# EAGLE design Main_oak_cm4_16 (EAGLE 9.6.2)
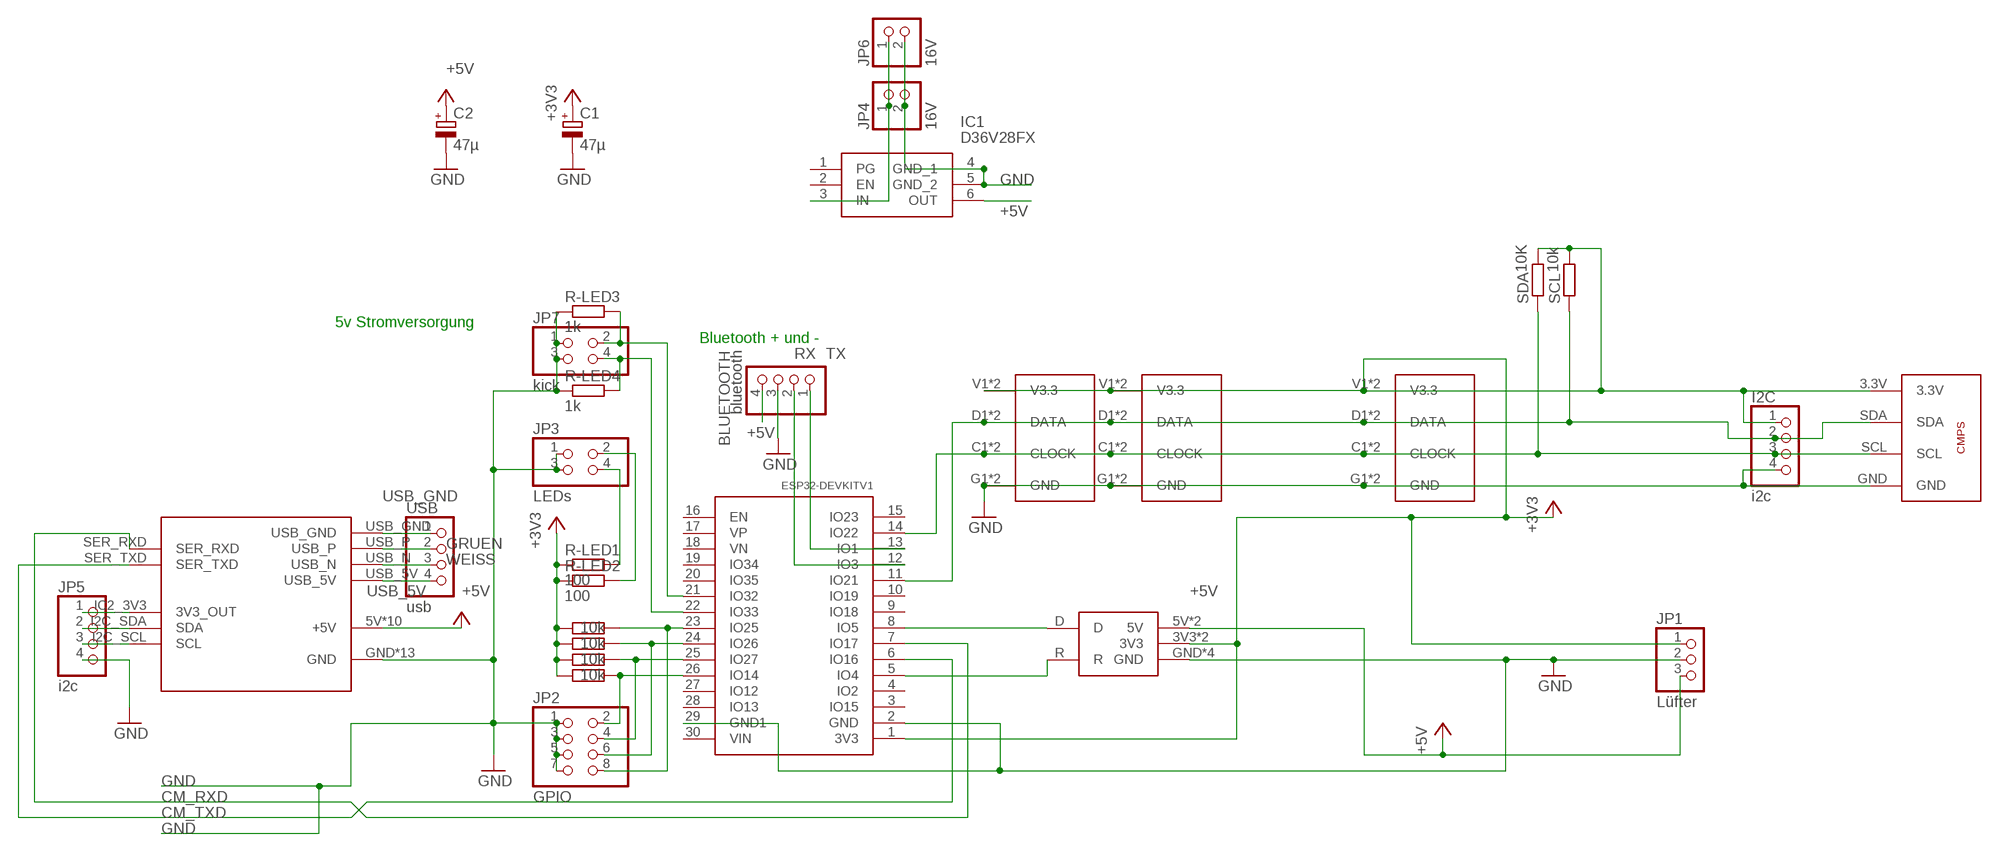
[diagram p0: schematic, sheet 1]

## Parts
BLUETOOTH  bluetooth  PINHD-1X4  [1X04]
C1  47µ  CPOL-EUE2,5-6E  [E2,5-6E]
C2  47µ  CPOL-EUE2,5-6E  [E2,5-6E]
I2C  i2c  PINHD-1X4  [1X04]
IC1  D36V28FX  [D36V28FX]
JP1  Lüfter  PINHD-1X3  [1X03]
JP2  GPIO  PINHD-2X4  [2X04]
JP3  LEDs  PINHD-2X2  [2X02]
JP4  16V  PINHD-1X2  [1X02]
JP5  i2c  PINHD-1X4  [1X04]
JP6  16V  PINHD-1X2  [1X02]
JP7  kick  PINHD-2X2  [2X02]
R-LED1  100  R-EU_0207/10  [0207/10]
R-LED2  100  R-EU_0207/10  [0207/10]
R-LED3  1k  R-EU_0207/10  [0207/10]
R-LED4  1k  R-EU_0207/10  [0207/10]
R_AD14  10k  R-EU_0207/10  [0207/10]
R_AD25  10k  R-EU_0207/10  [0207/10]
R_AD26  10k  R-EU_0207/10  [0207/10]
R_AD27  10k  R-EU_0207/10  [0207/10]
SCL  10k  R-EU_0207/10  [0207/10]
SDA  10K  R-EU_0207/10  [0207/10]
U$1  TASTER_LED  [TASTER_LED]
U$3  TASTER_LED  [TASTER_LED]
U$5  CM4-ADAPTER  [CM4-ADAPTER]
U$7  TASTER_LED  [TASTER_LED]
U$8  CMPS  [CMPS]
U$11  CANBUS  [CANBUS]
U$13  ESP32DEVKITV1  [ESP32-DEVKITV1]
USB  usb  PINHD-1X4  [1X04]

## Nets
+3V3: C1.+ I2C.1 JP1.1 R-LED1.1 R-LED2.1 R_AD14.1 R_AD25.1 R_AD26.1 R_AD27.1 SCL.2 SDA.2 U$1.V1(V3.3) U$1.V2(V3.3) U$3.V1(V3.3) U$3.V2(V3.3) U$7.V1(V3.3) U$7.V2(V3.3) U$8.3.3V U$11.3V3 U$11.3V3_1(3V3) U$13.1(3V3)
+5V: BLUETOOTH.4 C2.+ IC1.6(OUT) JP1.3 U$5.5V(+5V) U$5.5V.1(+5V) U$5.5V.2(+5V) U$5.5V.3(+5V) U$5.5V.4(+5V) U$5.5V.5(+5V) U$5.5V.6(+5V) U$5.5V.7(+5V) U$5.5V.8(+5V) U$5.5V.9(+5V) U$11.5V U$11.5V_1(5V)
CLOCK: I2C.3 SDA.1 U$1.C1(CLOCK) U$1.C2(CLOCK) U$3.C1(CLOCK) U$3.C2(CLOCK) U$7.C1(CLOCK) U$7.C2(CLOCK) U$8.SCL U$13.14(IO22)
CM_RXD: U$5.SER_RXD U$13.7(IO17)
CM_TXD: U$5.SER_TXD U$13.6(IO16)
D: U$11.D U$13.8(IO5)
DATA: I2C.2 SCL.1 U$1.D1(DATA) U$1.D2(DATA) U$3.D1(DATA) U$3.D2(DATA) U$7.D1(DATA) U$7.D2(DATA) U$8.SDA U$13.11(IO21)
GND: BLUETOOTH.3 C1.- C2.- I2C.4 IC1.4(GND_1) IC1.5(GND_2) JP1.2 JP2.1 JP2.3 JP2.5 JP2.7 JP3.1 JP3.3 JP4.2 JP5.4 JP6.2 JP7.1 JP7.3 R-LED3.1 R-LED4.1 U$1.G1(GND) U$1.G2(GND) U$3.G1(GND) U$3.G2(GND) U$5.GND U$5.GND1(GND) U$5.GND2(GND) U$5.GND3(GND) U$5.GND4(GND) U$5.GND5(GND) U$5.GND6(GND) U$5.GND7(GND) U$5.GND8(GND) U$5.GND9(GND) U$5.I2C_GND(GND) U$5.SER_GND2(GND) U$5.SER_GND(GND) U$7.G1(GND) U$7.G2(GND) U$8.GND U$11.GND U$11.GND_1(GND) U$11.GND_2(GND) U$11.GND_3(GND) U$13.2(GND) U$13.29(GND1)
GRUEN: U$5.USB_P USB.2
IO14: JP2.2 R_AD14.2 U$13.26(IO14)
IO25: JP2.8 R_AD25.2 U$13.23(IO25)
IO26: JP2.6 R_AD26.2 U$13.24(IO26)
IO27: JP2.4 R_AD27.2 U$13.25(IO27)
IO32: JP7.2 R-LED3.2 U$13.21(IO32)
IO33: JP7.4 R-LED4.2 U$13.22(IO33)
N$7: IC1.3(IN) JP4.1 JP6.1
N$8: JP3.4 R-LED1.2
N$9: JP3.2 R-LED2.2
N$10: JP5.1 U$5.IC2_3V3(3V3_OUT)
N$11: JP5.2 U$5.I2C_SDA(SDA)
N$12: JP5.3 U$5.I2C_SCL(SCL)
R: U$11.R U$13.5(IO4)
RX: BLUETOOTH.2 U$13.12(IO3)
TX: BLUETOOTH.1 U$13.13(IO1)
USB_5V: U$5.USB_5V USB.4
USB_GND: U$5.USB_GND USB.1
WEISS: U$5.USB_N USB.3
Unconnected: IC1.1(PG) IC1.2(EN) U$13.3(IO15) U$13.4(IO2) U$13.9(IO18) U$13.10(IO19) U$13.15(IO23) U$13.16(EN) U$13.17(VP) U$13.18(VN) U$13.19(IO34) U$13.20(IO35) U$13.27(IO12) U$13.28(IO13) U$13.30(VIN)

## Notes on the sheet
- 5v Stromversorgung
- Bluetooth + und -

## Library data of the parts
BLUETOOTH I2C JP5 USB = pinhead:PINHD-1X4: PIN HEADER
C1 C2 = rcl:CPOL-EU: POLARIZED CAPACITOR, European symbol; SPICEPREFIX: C
IC1 = D36V28FX:D36V28FX: 5V, 3.2A Step-Down Voltage Regulator D36V28F5 Source: Datasheet <https://www.pololu.com/product/3782>; DESCRIPTION: 5V, 3.2A Step-Down Voltage Regulator D36V28F5; HEIGHT: 8.77mm; MANUFACTURER_NAME: POLOLU ROBOTICS & ELECTRONICS; MANUFACTURER_PART_NUMBER: D36V28FX
JP1 = pinhead:PINHD-1X3: PIN HEADER
JP2 = pinhead:PINHD-2X4: PIN HEADER
JP3 JP7 = pinhead:PINHD-2X2: PIN HEADER
JP4 JP6 = pinhead:PINHD-1X2: PIN HEADER
R-LED1-R-LED4 R_AD14 R_AD25-R_AD27 SCL SDA = rcl:R-EU_: RESISTOR, European symbol; SPICEPREFIX: R
U$1 U$3 U$7 = Taster_LED:TASTER_LED: Taster / LED Board mit 2 Tastern und 2 LEDs Angeschlossen über i2c Port Expander PCF8574TS i2c Adresse zwingend per Lötbrücke zu setzen.
U$5 = cm4-adapter:CM4-ADAPTER
U$8 = cmps:CMPS: CMPS cmps11, cmps12, cmps14 Kompass-Sensor
U$11 = canbus:CANBUS
U$13 = ESP32-DEVKITV1:ESP32DEVKITV1

## Board
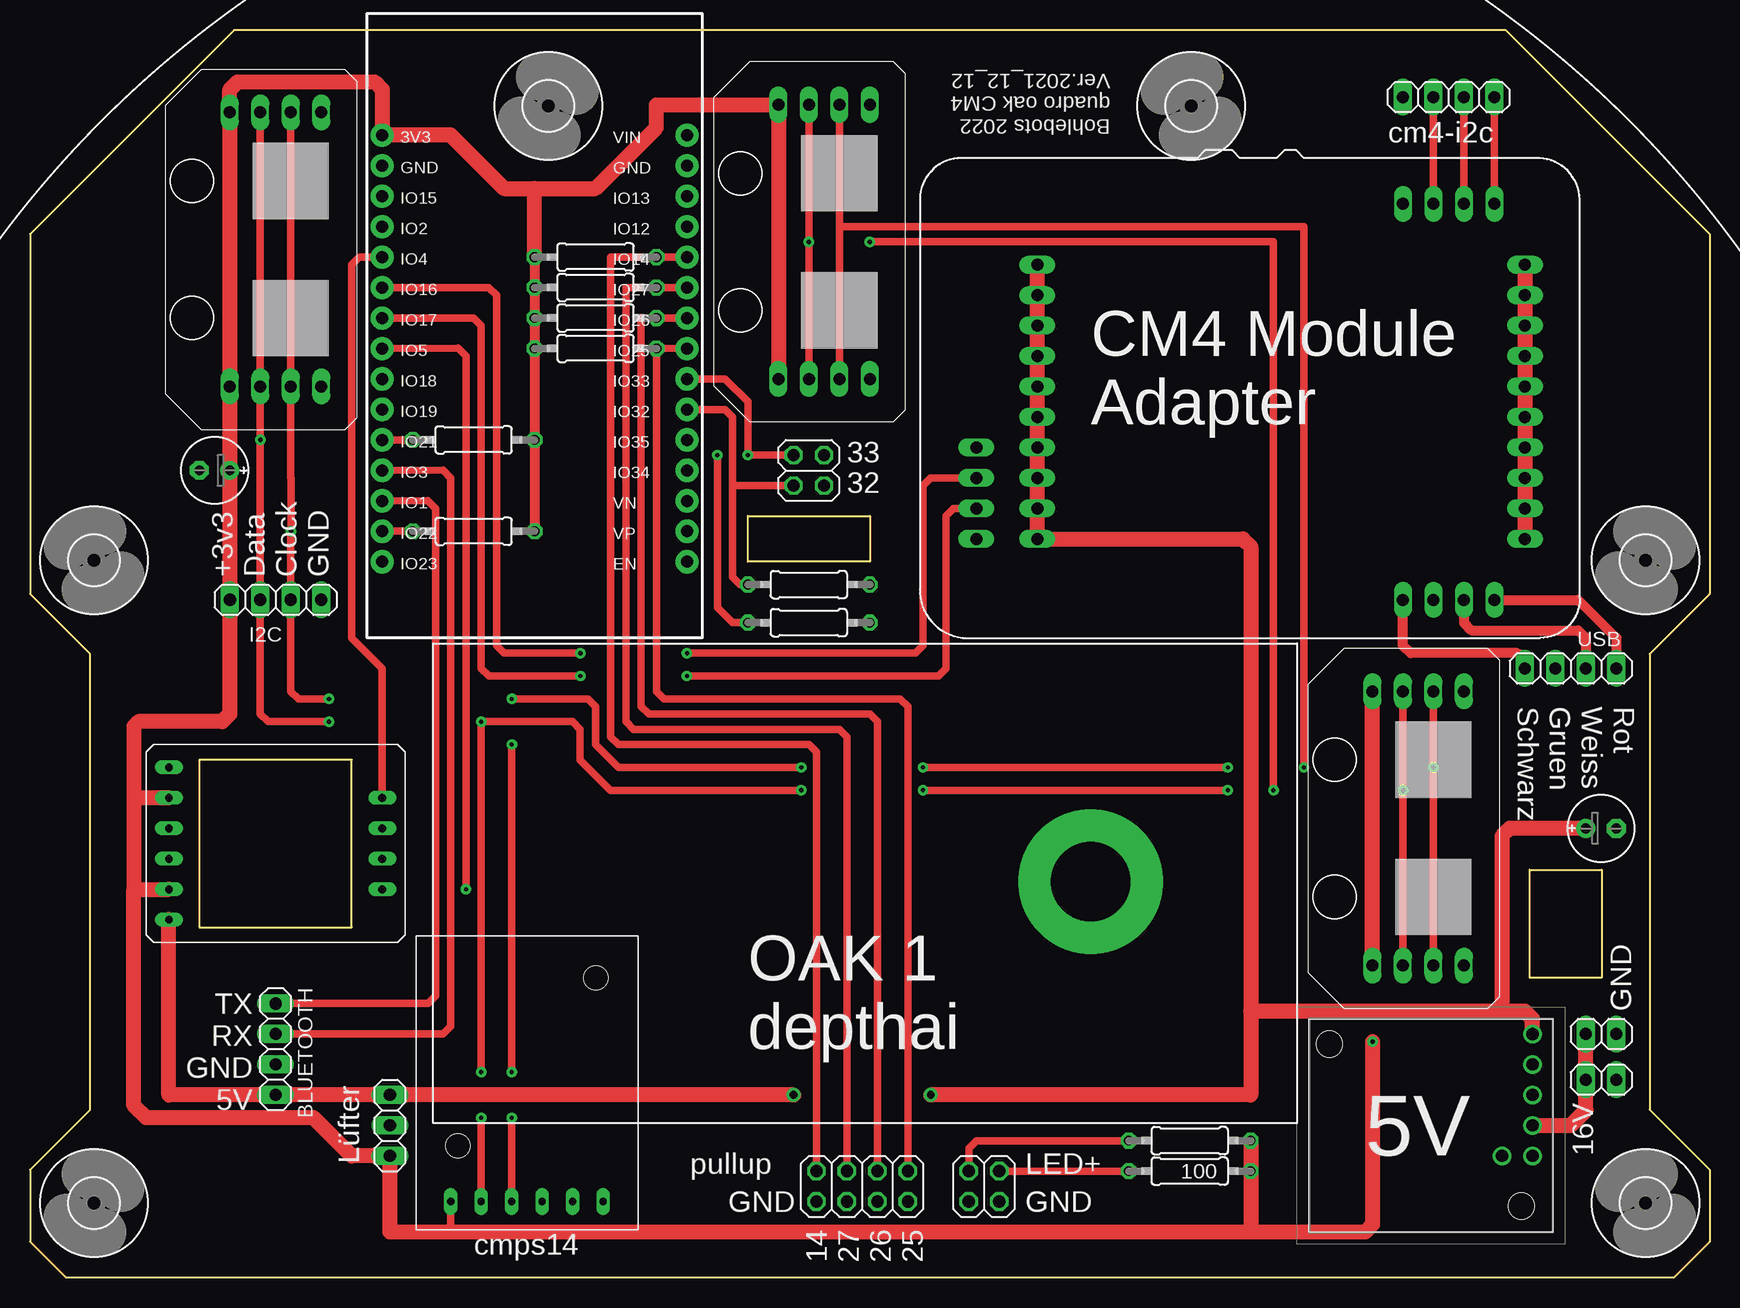
[diagram p1: board, top side]
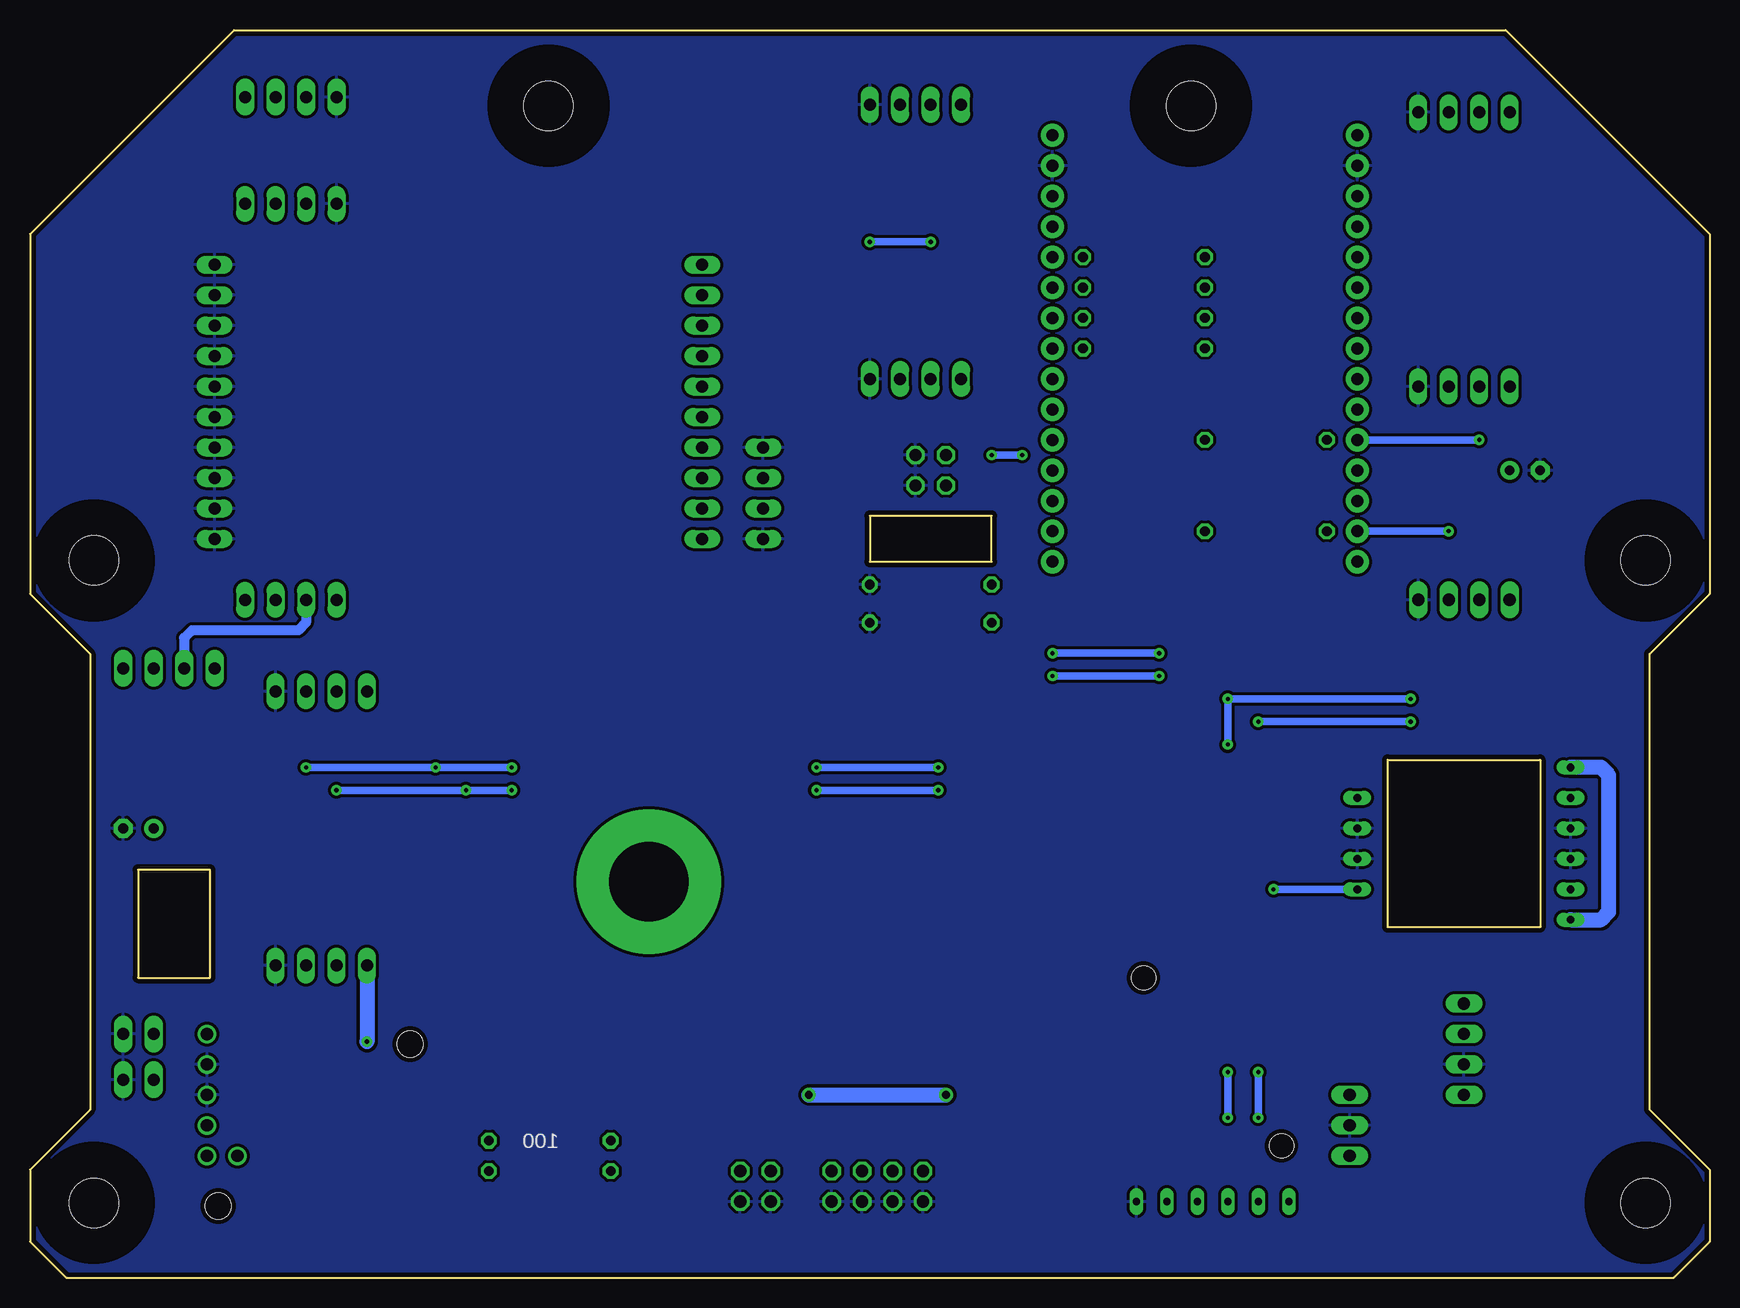
[diagram p2: board, bottom side, seen from below]

Size 140 x 104 mm. Coordinates in mm from the lower left corner, seen from the top.
Outline: 5,14 5,52 0,57 0,87 17,104 123,104 140,87 140,57 135,52 135,14 140,9 140,3 137,0 3,0 0,3 0,9 5,14
Outline: 14.12,43.16 14.12,29.19 26.82,29.19 26.82,43.16 14.12,43.16
Outline: 131,25 125,25 125,34 131,34 131,25
Outline: 59.84,63.48 70,63.48 70,59.67 59.84,59.67 59.84,63.48
Copper layers (1*16): Top 0.035mm / dielectric 1.5mm / Bottom 0.035mm
Design rules "default *": minimum track width 10mil, minimum drill 8mil, track to track 10mil, track to pad 10mil, pad to pad 10mil, via to via 10mil, smd to smd 10mil, copper to edge 15mil, drill to drill 8mil, minimum pad ring 10mil, minimum via ring 10mil, stop-mask expansion 0mil, vias tented up to drill 0mil, thermal gap 10mil

### Footprints (pad centres in the part's own frame; a part is rotated, then mirrored left to right if it is on the bottom)
1X04 = drill 1.016 long: 1 -3.81,0; 2 -1.27,0; 3 1.27,0; 4 3.81,0
E2,5-6E = drill 0.813 pad 1.575: + -1.27,0 | drill 0.813 pad 1.575 octagon: - 1.27,0
D36V28FX = drill 1.02 pad 1.53: 1 0,0; 2 0,-2.54; 3 2.54,-2.54; 4 5.08,-2.54; 5 7.62,-2.54; 6 10.16,-2.54 | hole 2.18: -4.17,-1.61; 9.33,14.39
1X03 = drill 1.016 long: 1 -2.54,0; 2 0,0; 3 2.54,0
2X04 = drill 1.016 octagon: 1 -3.81,-1.27; 2 -3.81,1.27; 3 -1.27,-1.27; 4 -1.27,1.27; 5 1.27,-1.27; 6 1.27,1.27; 7 3.81,-1.27; 8 3.81,1.27
2X02 = drill 1.016 octagon: 1 -1.27,-1.27; 2 -1.27,1.27; 3 1.27,-1.27; 4 1.27,1.27
1X02 = drill 1.016 long: 1 -1.27,0; 2 1.27,0
0207/10 = drill 0.813 octagon: 1 -5.08,0; 2 5.08,0
TASTER_LED = drill 1 long: C1 -11.43,-4.445; C2 11.43,-4.445; D1 -11.43,-1.905; D2 11.43,-1.905; G1 -11.43,-6.985; G2 11.43,-6.985; V1 -11.43,0.635; V2 11.43,0.635
4,1 = hole 4.1: 0,0
CM4-ADAPTER = drill 1 long: 5V -17.78,11.43; 5V.1 -17.78,8.89; 5V.2 -17.78,6.35; 5V.3 -17.78,3.81; 5V.4 -17.78,1.27; 5V.5 -17.78,-1.27; 5V.6 -17.78,-3.81; 5V.7 -17.78,-6.35; 5V.8 -17.78,-8.89; 5V.9 -17.78,-11.43; GND 22.86,11.43; GND1 22.86,8.89; GND2 22.86,6.35; GND3 22.86,3.81; GND4 22.86,1.27; GND5 22.86,-1.27; GND6 22.86,-3.81; GND7 22.86,-6.35; GND8 22.86,-8.89; GND9 22.86,-11.43; I2C_GND 12.7,16.51; I2C_SCL 15.24,16.51; I2C_SDA 17.78,16.51; IC2_3V3 20.32,16.51; SER_GND -22.86,-11.43; SER_GND2 -22.86,-3.81; SER_RXD -22.86,-8.89; SER_TXD -22.86,-6.35; USB_5V 20.32,-16.51; USB_GND 12.7,-16.51; USB_N 17.78,-16.51; USB_P 15.24,-16.51
CMPS = drill 0.6 long: 3.3V -6.35,-10.16; GND 6.35,-10.16; MODE 1.27,-10.16; NN 3.81,-10.16; SCL -1.27,-10.16; SDA -3.81,-10.16 | hole 2: -5.75,-5.5; 5.75,8.5
CANBUS = drill 0.65 long: 3V3 8.89,3.81; 3V3_1 8.89,-3.81; 5V 8.89,6.35; 5V_1 8.89,-6.35; D -8.89,3.81; GND -8.89,1.27; GND_1 -8.89,-1.27; GND_2 8.89,1.27; GND_3 8.89,-1.27; R -8.89,-3.81
ESP32-DEVKITV1 = drill 1 pad 1.93: 1 -22.86,-12.7; 2 -20.32,-12.7; 3 -17.78,-12.7; 4 -15.24,-12.7; 5 -12.7,-12.7; 6 -10.16,-12.7; 7 -7.62,-12.7; 8 -5.08,-12.7; 9 -2.54,-12.7; 10 0,-12.7; 11 2.54,-12.7; 12 5.08,-12.7; 13 7.62,-12.7; 14 10.16,-12.7; 15 12.7,-12.7; 16 12.7,12.7; 17 10.16,12.7; 18 7.62,12.7; 19 5.08,12.7; 20 2.54,12.7; 21 0,12.7; 22 -2.54,12.7; 23 -5.08,12.7; 24 -7.62,12.7; 25 -10.16,12.7; 26 -12.7,12.7; 27 -15.24,12.7; 28 -17.78,12.7; 29 -20.32,12.7; 30 -22.86,12.7

### Placement (x,y rotation side)
BLUETOOTH  20.47,19.03 270 top
C1  15.39,67.29 180 top
C2  130.96,37.45 0 top
I2C  20.47,56.5 0 top
IC1  122.7,10.14 90 top
JP1  29.99,12.68 90 top
JP2  69.36,7.6 0 top
JP3  79.53,7.6 0 top
JP4  130.96,20.3 0 top
JP5  118.26,98.41 180 top
JP6  130.96,16.49 0 top
JP7  64.92,67.29 90 top
R-LED1  96.67,8.87 180 top
R-LED2  96.67,11.41 180 top
R-LED3  64.92,57.77 180 top
R-LED4  64.92,54.59 180 top
R_AD14  47.14,85.07 0 top
R_AD25  47.14,77.45 0 top
R_AD26  47.14,79.99 0 top
R_AD27  47.14,82.53 0 top
SCL  36.98,69.83 0 top
SDA  36.98,62.21 0 top
U$1  63.02,86.34 90 top
U$2  [4,1]  5.33,59.79 67.5 top
U$3  112.55,37.45 90 top
U$4  [4,1]  96.79,97.67 67.5 top
U$5  101.75,73 0 top
U$6  [4,1]  134.67,6.21 67.5 top
U$7  17.3,85.7 90 top
U$8  41.42,16.49 0 top
U$9  [4,1]  43.21,97.67 22.5 top
U$10  [4,1]  134.67,59.79 22.5 top
U$11  20.47,36.17 180 top
U$12  [4,1]  5.33,6.21 22.5 top
U$13  42.06,72.37 270 top
USB  128.42,50.78 0 top

### Tracks (layer width: path | path; a pad name or v marks a point on that pad's centre or on a via)
+3V3  (via drill 0.35)
  Top 0.61: U$8.3.3V 35.08,3.79
  Top 0.813: R_AD14.1 R_AD27.1 R_AD26.1 R_AD25.1 SCL.2 SDA.2
  Top 1.27: 42.06,90.78 39.52,90.78 35.06,95.24 U$13.1 29.36,99.04 28.73,99.67 17.3,99.67 16.66,99.04 U$7.V2 U$7.V1 C1.+ I2C.1 16.66,46.97 16.02,46.34 9.04,46.34 8.66,45.95 8.66,39.98 | 42.06,90.78 47.14,90.78 52.22,95.87 52.22,97.77 U$1.V2 U$1.V1 | U$3.V1 U$3.V2 | v111.91,19.66 111.91,4.43 111.28,3.79 101.75,3.79 | 101.75,3.79 35.08,3.79 29.99,3.79 JP1.1 26.82,10.14 23.65,13.32 9.67,13.32 8.66,14.33 8.66,32.37 | R-LED2.1 R-LED1.1 101.75,3.79 | R_AD14.1 42.06,90.78 | U$11.3V3_1 8.66,39.98 | 8.66,32.37 U$11.3V3 | 8.66,39.98 8.66,32.37
  Bottom 1.27: U$3.V1 v111.91,19.66
+5V  (via drill 0.65)
  Top 1.27: U$5.5V U$5.5V.1 U$5.5V.2 U$5.5V.3 U$5.5V.4 U$5.5V.5 U$5.5V.6 U$5.5V.7 U$5.5V.8 U$5.5V.9 101.11,61.58 101.75,60.94 101.75,22.2 | 101.75,22.2 101.75,15.22 v75.08,15.22 | IC1.6 125.25,21.57 124.61,22.2 122.7,22.2 | 122.7,22.2 101.75,22.2 | v63.65,15.22 JP1.3 BLUETOOTH.4 11.58,15.22 U$11.5V | C2.+ 123.34,37.45 122.7,36.81 122.7,22.2
  Bottom 1.27: v75.08,15.22 v63.65,15.22 | U$11.5V 9.04,29.82 8.41,30.46 8.41,41.89 9.04,42.52 U$11.5V_1
CLOCK  (via drill 0.35)
  Top 0.61: U$13.14 SDA.1 | U$7.C2 U$7.C1 21.74,66.66 21.75,66.65 v21.75,62.22 v21.74,62.21 I2C.3 21.74,48.88 22.38,48.24 v24.91,48.24 | U$1.C1 67.46,87.61 | 67.46,87.61 U$1.C2 | 67.46,87.61 106.19,87.61 v106.19,42.52 | U$3.C2 v116.99,42.52 U$3.C1 | v99.84,42.52 v74.44,42.52 | v64.28,42.52 49.05,42.52 47.14,44.43 47.14,47.61 46.5,48.24 v40.16,48.24 | U$8.SCL v40.16,13.32 | v40.16,17.12 v40.16,44.43
  Bottom 0.61: U$13.14 v21.75,62.22 | v116.99,42.52 v106.19,42.52 v99.84,42.52 | v74.44,42.52 v64.28,42.52 | v24.91,48.24 v40.16,48.24 v40.16,44.43 | v40.16,13.32 v40.16,17.12
CM_RXD  (via drill 0.35)
  Top 0.61: U$13.7 36.97,80 37.62,79.35 37.62,50.78 38.25,50.14 v45.87,50.14 | U$5.SER_RXD 76.98,64.11 76.35,63.48 76.35,50.78 75.72,50.14 v54.76,50.14
  Bottom 0.61: v54.76,50.14 v45.87,50.14
CM_TXD  (via drill 0.35)
  Top 0.61: U$13.6 38.24,82.54 38.89,81.9 38.89,52.69 39.52,52.05 v45.87,52.05 | U$5.SER_TXD 75.08,66.66 74.44,66.02 74.44,52.69 73.81,52.05 v54.76,52.05
  Bottom 0.61: v54.76,52.05 v45.87,52.05
D  (via drill 0.35)
  Top 0.61: U$13.8 35.7,77.46 36.34,76.81 v36.34,32.37
  Bottom 0.61: v36.34,32.37 U$11.D
DATA  (via drill 0.35)
  Top 0.61: U$7.D2 U$7.D1 v19.2,69.83 I2C.2 19.2,46.97 19.84,46.34 v24.91,46.34 | U$1.D1 v64.92,86.34 U$1.D2 | v70,86.34 103.66,86.34 v103.66,40.62 | U$3.D2 v114.45,40.62 U$3.D1 | v74.44,40.62 v99.84,40.62 | v64.28,40.62 48.41,40.62 45.87,43.16 45.87,45.7 45.23,46.34 v37.62,46.34 v37.62,17.12 | U$8.SDA v37.62,13.32 | SCL.1 U$13.11
  Bottom 0.61: v64.92,86.34 v70,86.34 | v114.45,40.62 v103.66,40.62 v99.84,40.62 | v64.28,40.62 v74.44,40.62 | v37.62,46.34 v24.91,46.34 | v37.62,13.32 v37.62,17.12 | U$13.11 v19.2,69.83
GND
  Top 1.27: U$5.GND U$5.GND1 U$5.GND2 U$5.GND3 U$5.GND4 U$5.GND5 U$5.GND6 U$5.GND7 U$5.GND8 U$5.GND9
  pour Bottom: 31.33,125.77 108.67,125.77 141.77,92.67 141.77,4.33 130.67,-6.77 9.33,-6.77 -1.77,4.33 -1.77,92.67
GRUEN
  Bottom 0.813: U$5.USB_P 116.99,54.59 117.62,53.95 126.52,53.95 127.15,53.32 USB.2
IO14
  Top 0.61: U$13.26 R_AD14.2 48.41,85.07 48.41,45.06 49.05,44.43 64.92,44.43 65.56,43.8 JP2.2
IO25
  Top 0.61: U$13.23 R_AD25.2 52.22,48.88 52.86,48.24 72.54,48.24 73.17,47.61 JP2.8
IO26
  Top 0.61: U$13.24 R_AD26.2 50.95,79.99 50.95,47.61 51.59,46.97 70,46.97 70.64,46.34 JP2.6
IO27
  Top 0.61: U$13.25 R_AD27.2 49.68,82.53 49.68,46.34 50.31,45.7 67.46,45.7 68.09,45.06 JP2.4
IO32
  Top 0.61: R-LED3.2 59.2,57.77 58.57,58.4 58.57,66.02 | U$13.21 57.94,72.37 58.57,71.73 58.57,66.02 | JP7.2 58.57,66.02
IO33  (via drill 0.35)
  Top 0.61: R-LED4.2 58.57,54.59 57.3,55.86 v57.3,68.56 | U$13.22 57.94,74.91 59.84,73 v59.84,68.56 JP7.4
  Bottom 0.61: v59.84,68.56 v57.3,68.56
N$7
  Top 1.27: IC1.3 128.42,12.68 129.69,13.95 JP6.1 JP4.1
N$8
  Top 0.61: JP3.4 R-LED1.2
N$9
  Top 0.61: R-LED2.2 78.89,11.41 78.25,10.77 JP3.2
N$10
  Top 0.61: JP5.1 U$5.IC2_3V3
N$11
  Top 0.61: JP5.2 U$5.I2C_SDA
N$12
  Top 0.61: JP5.3 U$5.I2C_SCL
N$13  (via drill 6.6 pad 12.06)
  other vias: 88.41,33
R
  Top 0.61: U$13.5 27.45,85.07 26.82,84.44 26.82,53.32 29.36,50.78 U$11.R
RX
  Top 0.61: U$13.12 34.43,67.3 35.08,66.66 35.08,20.94 34.44,20.3 BLUETOOTH.2
TX
  Top 0.61: U$13.13 33.16,64.76 33.8,64.11 33.8,23.48 33.17,22.84 BLUETOOTH.1
USB_5V
  Top 0.813: U$5.USB_5V 129.06,56.5 132.23,53.32 USB.4
USB_GND
  Top 0.813: USB.1 124.61,51.41 123.97,52.05 115.09,52.05 114.45,52.69 U$5.USB_GND
WEISS
  Top 0.813: U$5.USB_N 119.53,54.59 120.16,53.95 129.06,53.95 129.69,53.32 USB.3

### Text on the board
tNames: Bohlebots 2022 / quadro oak CM4 / Ver.2021_12_12 | cm4-i2c | CM4 Module / Adapter | 33 | 32 | +3v3 / Data / Clock / GND | Rot / Weiss / Gruen / Schwarz | GND | OAK 1 / depthai | TX / RX / GND / 5V | Lüfter | 5V | 16V | pullup | LED+ | GND | GND | cmps14 | 14 / 27 / 26 / 25